# Altium schematic sheet wtc_sh3.SchDoc
size A3; SheetNumber: 3; SheetTotal: 4
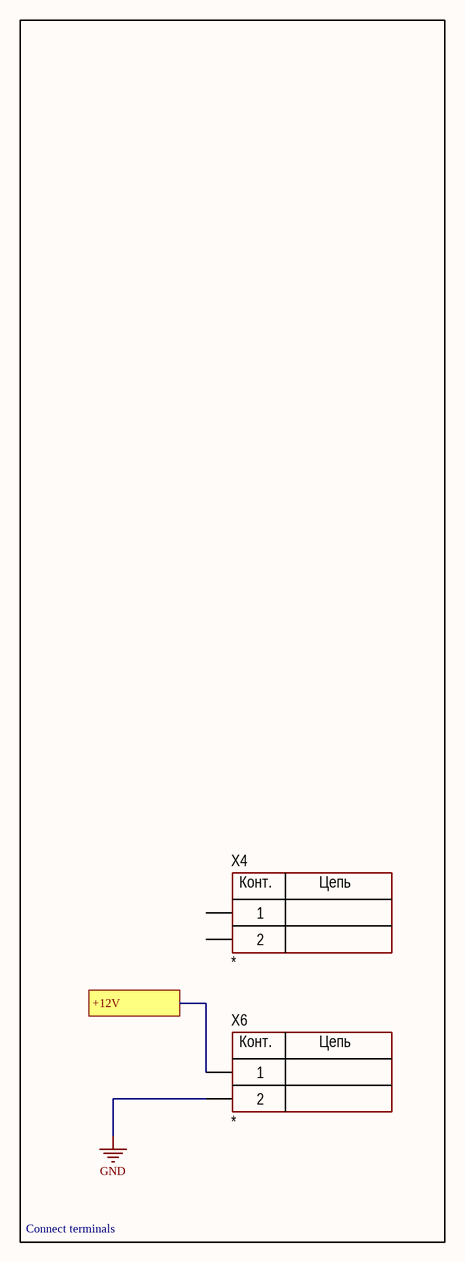
[diagram p0: wtc_sh3.SchDoc]

## Parts
X4  *  [CON: CWF-2]
X6  *  [CON: CWF-2]

## Blocks framed on the sheet
Connect terminals: X4 X6

## Ports
+12V

## Nets
GND: X6.2
+12V: X6.1 ; port +12V

Not connected (* = marked no-connect by the designer): X4 1 2

## Notes on the sheet
- (in symbol 2-Connector) Конт.; Цепь

## Library data of the parts
X4 X6 = 2-Connector: Model: *; Manufacturer: *; HelpURL: *; ComponentKind: *